# EAGLE design DC4dazzer2 (EAGLE 6.3)
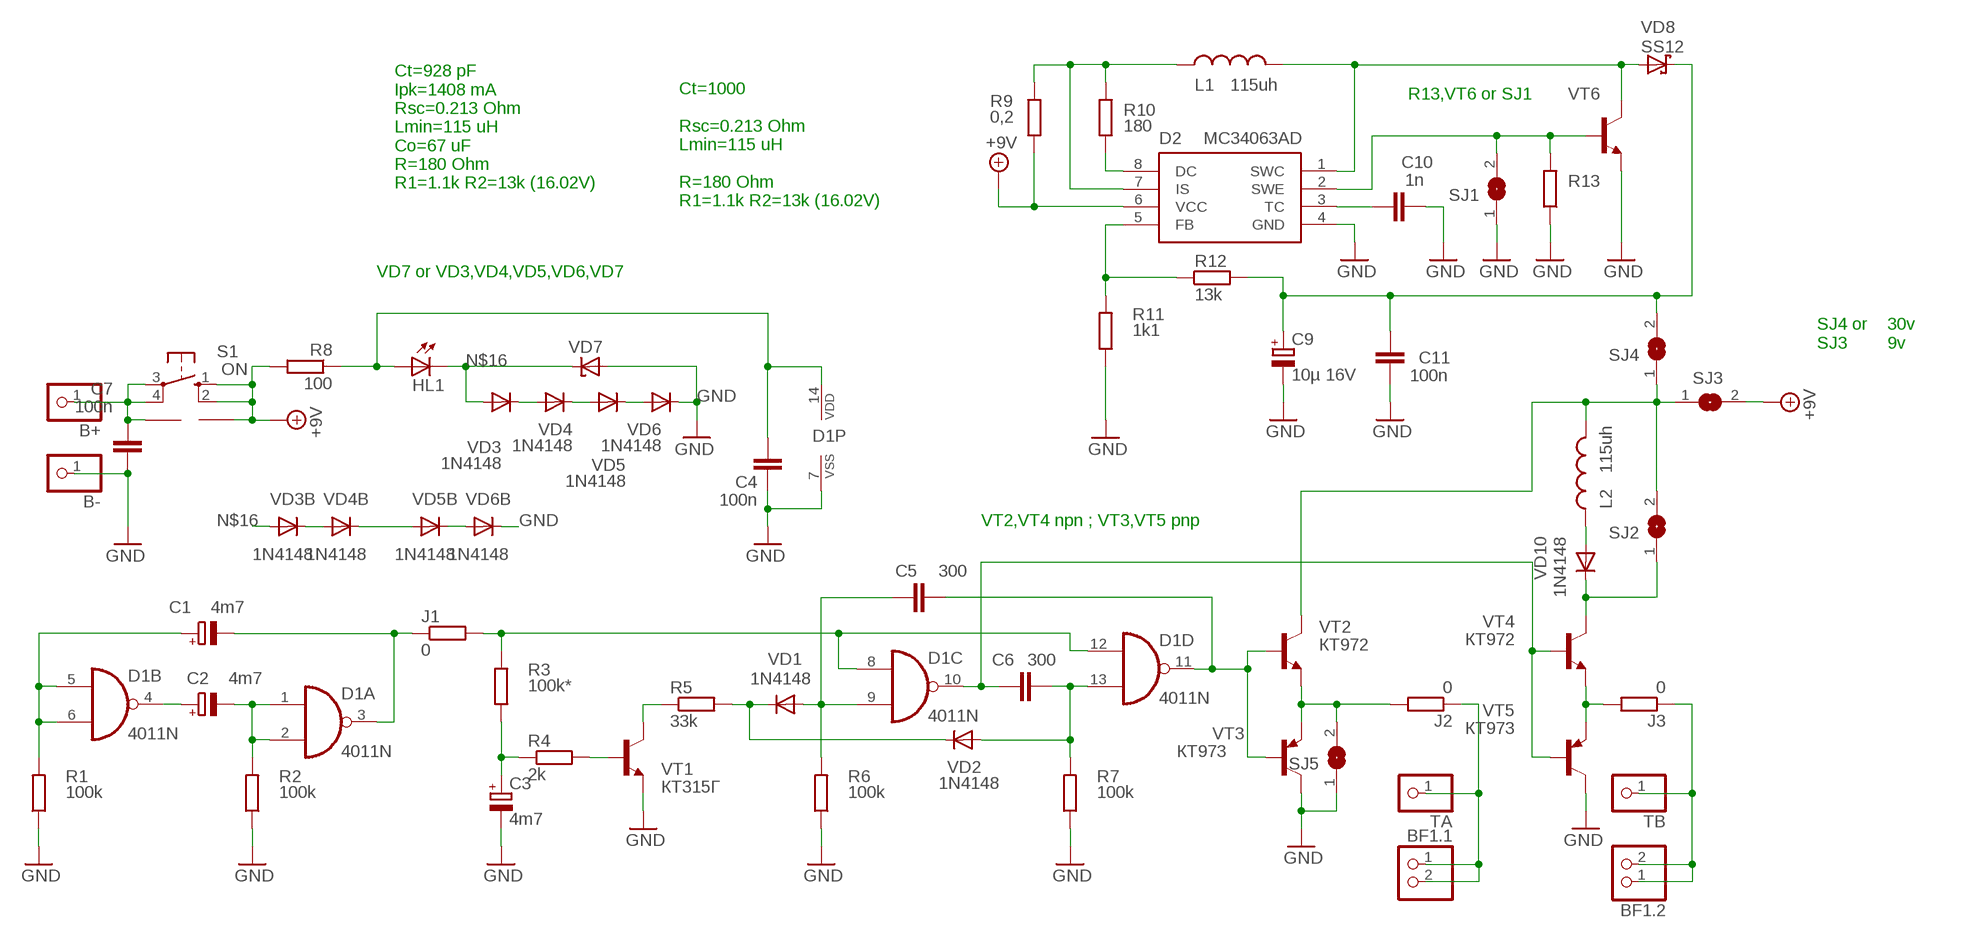
[diagram p0: schematic, sheet 1]

## Parts
B+  PINHD-1X1  [1X01]
B-  PINHD-1X1  [1X01]
BF1.1  PINHD-1X2  [1X02]
BF1.2  PINHD-1X2  [1X02]
C1  4m7  CPOL-EUE3.5-8  [E3,5-8]
C2  4m7  CPOL-EUE2.5-7  [E2,5-7]
C3  4m7  CPOL-EUE2.5-7  [E2,5-7]
C4  100n  C-EUC0805  [C0805]
C5  300  CAPPTH3  [CAP-PTH-LARGE]
C6  300  CAPPTH3  [CAP-PTH-LARGE]
C7  100n  C-EU025-024X044  [C025-024X044]
C9  10µ 16V  RCL_CPOL-EUE3.5-8  [RCL_E3,5-8]
C10  1n  C-EU025-025X050  [C025-025X050]
C11  100n  C-EUC0805  [C0805]
D1  4011N  [DIL14]
D2  MC34063AD  [SOIC8]
HL1  LED5MM  [LED5MM]
J1  0  R-EU_R1206W  [R1206W]
J2  0  R-EU_R1206W  [R1206W]
J3  0  R-EU_R1206W  [R1206W]
L1  115uh  L-US0207/10  [0207/10]
L2  115uh  L-US0204/5  [0204/5]
R1  100k  R-EU_R0805  [R0805]
R2  100k  R-EU_R0805  [R0805]
R3  100k*  R-EU_0204/7  [0204/7]
R4  2k  R-EU_R0805  [R0805]
R5  33k  R-EU_R1206W  [R1206W]
R6  100k  R-EU_R1206W  [R1206W]
R7  100k  R-EU_M0805  [M0805]
R8  100  R-EU_0204/5  [0204/5]
R9  0,2  R-EU_0204/7  [0204/7]
R10  180  R-EU_0204/7  [0204/7]
R11  1k1  R-EU_M0805  [M0805]
R12  13k  R-EU_M0805  [M0805]
R13  R-EU_0204/7  [0204/7]
S1  ON  10-XX  [B3F-10XX]
SJ1  SJ  [SJ]
SJ2  SJ  [SJ]
SJ3  SJ  [SJ]
SJ4  SJ  [SJ]
SJ5  SJ  [SJ]
TA  PINHD-1X1  [1X01]
TB  PINHD-1X1  [1X01]
U$2  PROGRAMMER_5.08  [PROGRAMMER_KEY]
VD1  1N4148  DIODE-SOD80C  [SOD80C]
VD2  1N4148  DIODE-SOD80C  [SOD80C]
VD3  1N4148  1N4148DO35-7  [DO35-7]
VD3B  1N4148  DIODE-SOD80C  [SOD80C]
VD4  1N4148  1N4148DO35-7  [DO35-7]
VD4B  1N4148  DIODE-SOD80C  [SOD80C]
VD5  1N4148  1N4148DO35-7  [DO35-7]
VD5B  1N4148  DIODE-SOD80C  [SOD80C]
VD6  1N4148  1N4148DO35-7  [DO35-7]
VD6B  1N4148  DIODE-SOD80C  [SOD80C]
VD7  ZENER-DIODEZD-7.5  [ZDIO-7.5]
VD8  SS12  SCHOTTKY-DIODESMD  [SMB]
VD10  1N4148  DIODE-SOD80C  [SOD80C]
VT1  КТ315Г  BC167-NPN-TO92-ECB  [TO92-ECB]
VT2  КТ972  BC167-NPN-TO92-ECB  [TO92-ECB]
VT3  КТ973  BC369-PNP-TO92-BCE  [TO92-BCE]
VT4  КТ972  BC167-NPN-TO92-ECB  [TO92-ECB]
VT5  КТ973  BC369-PNP-TO92-BCE  [TO92-BCE]
VT6  BC167-NPN-TO92-ECB  [TO92-ECB]

## Nets
+9V: D2.6(VCC) R8.2 R9.1 S1.1(S) S1.2(S1) SJ3.2 U$2.P$2
B+: B+.1 C7.1 S1.3(P) S1.4(P1) U$2.P$1
GND: B-.1 C3.- C4.2 C7.2 C9.- C10.2 C11.1 D1.7(P:VSS) D2.4(GND) R1.1 R2.1 R6.1 R7.1 R11.1 R13.1 SJ1.1 SJ5.1 VD6.C VD6B.C VD7.A VT1.E VT3.C VT5.C VT6.E
N$1: C1.+ D1.5(B:I0) D1.6(B:I1) R1.2
N$2: C2.+ D1.4(B:O)
N$3: C2.- D1.1(A:I0) D1.2(A:I1) R2.2
N$4: D1.8(C:I0) D1.12(D:I0) J1.2 R3.2
N$5: C3.+ R3.1 R4.1
N$6: R4.2 VT1.B
N$7: R5.1 VT1.C
N$8: R5.2 VD1.C VD2.C
N$9: C5.1 D1.9(C:I1) R6.2 VD1.A
N$10: C6.1 D1.10(C:O) VT4.B VT5.B
N$11: C6.2 D1.13(D:I1) R7.2 VD2.A
N$12: J2.2 SJ5.2 VT2.E VT3.E
N$13: J3.2 VT4.E VT5.E
N$14: C5.2 D1.11(D:O) VT2.B VT3.B
N$15: C1.- D1.3(A:O) J1.1
N$16: HL1.K(C) VD3.A VD3B.A VD7.C
N$17: D2.8(DC) R10.1
N$19: BF1.2.1 BF1.2.2 J3.1 TB.1
N$20: D2.7(IS) L1.1 R9.2 R10.2
N$21: VD3.C VD3B.C VD4.A VD4B.A
N$22: VD4.C VD4B.C VD5.A VD5B.A
N$23: VD5.C VD5B.C VD6.A VD6B.A
N$24: BF1.1.1 BF1.1.2 J2.1 TA.1
N$25: D2.5(FB) R11.2 R12.1
N$26: D2.2(SWE) R13.2 SJ1.2 VT6.B
N$27: C10.1 D2.3(TC)
N$28: D2.1(SWC) L1.2 VD8.A VT6.C
N$29: C9.+ C11.2 R12.2 SJ4.2 VD8.C
N$30: L2.1 VD10.A
N$31: SJ2.1 VD10.C VT4.C
N$33: L2.2 SJ2.2 SJ3.1 SJ4.1 VT2.C
~+5V: C4.1 D1.14(P:VDD) HL1.A R8.1

## Notes on the sheet
- R13,VT6 or SJ1
- Ct=928 pF
  Ipk=1408 mA
  Rsc=0.213 Ohm
  Lmin=115 uH
  Co=67 uF
  R=180 Ohm
  R1=1.1k R2=13k (16.02V)
- Ct=1000
  
  Rsc=0.213 Ohm
  Lmin=115 uH
  
  R=180 Ohm
  R1=1.1k R2=13k (16.02V)
- VD7 or VD3,VD4,VD5,VD6,VD7
- SJ4 or    30v
  SJ3        9v
- VT2,VT4 npn ; VT3,VT5 pnp

## Library data of the parts
B+ B- TA TB = pinhead:PINHD-1X1: PIN HEADER
BF1.1 BF1.2 = pinhead:PINHD-1X2: PIN HEADER
C1-C3 = rcl:CPOL-EU: POLARIZED CAPACITOR, European symbol
C4 C10 C11 = rcl:C-EU: CAPACITOR, European symbol
C5 C6 = SparkFun-Capacitors:CAP: Capacitor Standard 0603 ceramic capacitor, and 0.1" leaded capacitor.
C7 = rc-elektronik:C-EU: CAPACITOR, European symbol
C9 = HWProgUSB:RCL_CPOL-EU: POLARIZED CAPACITOR, European symbol
D1 = 40xx:4011: Quad 2-input NAND
D2 = mc34063:MC34063
HL1 = led:LED: LED OSRAM: - CHIPLED LG R971, LG N971, LY N971, LG Q971, LY Q971, LO R971, LY R971 LH N974, LH R974 LS Q976, LO Q976, LY Q976 LO Q996 - Hyper CHIPLED LW Q18S LB Q993, LB Q99A, LB R99A - SideLED LS A670, LO A670, LY A670, LG A670, LP A670 LB A673, LV A673, LT A673, LW A673 LH A674 LY A675 LS A676, LA A676, LO A676, LY A676, LW A676 LS A679, LY A679, LG A679 - Hyper Micro SIDELED® LS Y876, LA Y876, LO Y876, LY Y876 LT Y87S - SmartLED LW L88C, LW L88S LB L89C, LB L89S, LG L890 LS L89K, LO L89K, LY L89K LS L896, LA L896, LO L896, LY L896 - TOPLED LS T670, LO T670, LY T670, LG T670, LP T670 LSG T670, LSP T670, LSY T670, LOP T670, LYG T670 LG T671, LOG T671, LSG T671 LB T673, LV T673, LT T673, LW T673 LH T674 LS T676, LA T676, LO T676, LY T676, LB T676, LH T676, LSB T676, LW T676 LB T67C, LV T67C, LT T67C, LS T67K, LO T67K, LY T67K, LW E67C LS E67B, LA E67B, LO E67B, LY E67B, LB E67C, LV E67C, LT E67C LW T67C LS T679, LY T679, LG T679 LS T770, LO T770, LY T770, LG T770, LP T770 LB T773, LV T773, LT T773, LW T773 LH T774 LS E675, LA E675, LY E675, LS T675 LS T776, LA T776, LO T776, LY T776, LB T776 LHGB T686 LT T68C, LB T68C - Hyper Mini TOPLED® LB M676 - Mini TOPLED Santana® LG M470 LS M47K, LO M47K, LY M47K Source: http://www.osram.convergy.de LUXEON: - LUMILED® LXK2-PW12-R00, LXK2-PW12-S00, LXK2-PW14-U00, LXK2-PW14-V00 LXK2-PM12-R00, LXK2-PM12-S00, LXK2-PM14-U00 LXK2-PE12-Q00, LXK2-PE12-R00, LXK2-PE12-S00, LXK2-PE14-T00, LXK2-PE14-U00 LXK2-PB12-K00, LXK2-PB12-L00, LXK2-PB12-M00, LXK2-PB14-N00, LXK2-PB14-P00, LXK2-PB14-Q00 LXK2-PR12-L00, LXK2-PR12-M00, LXK2-PR14-Q00, LXK2-PR14-R00 LXK2-PD12-Q00, LXK2-PD12-R00, LXK2-PD12-S00 LXK2-PH12-R00, LXK2-PH12-S00 LXK2-PL12-P00, LXK2-PL12-Q00, LXK2-PL12-R00 Source: www.luxeon.com KINGBRIGHT: KA-3528ASYC Source: www.kingbright.com
J1-J3 R1-R13 = rcl:R-EU_: RESISTOR, European symbol
L1 L2 = rcl:L-US: INDUCTOR, American symbol
S1 = switch-omron:10-XX: OMRON SWITCH; MPN: B3F-1000; OC_FARNELL: 176432; OC_NEWARK: 36M3542
SJ1-SJ5 = jumper:SJ: SMD solder JUMPER
U$2 = HWProgUSB:PROGRAMMER_5.08
VD1 VD2 VD3B VD4B VD5B VD6B VD10 = diode:DIODE-: DIODE
VD3-VD6 = diode:1N4148: DIODE high speed (Philips)
VD7 = diode:ZENER-DIODE: Z-Diode
VD8 = diode:SCHOTTKY-DIODE: Schottky Diode
VT1 VT2 VT4 VT6 = transistor:*-NPN-: NPN Transistror BF959 corrected 2008.03.06
VT3 VT5 = transistor:*-PNP-: PNP Transistror

## Board
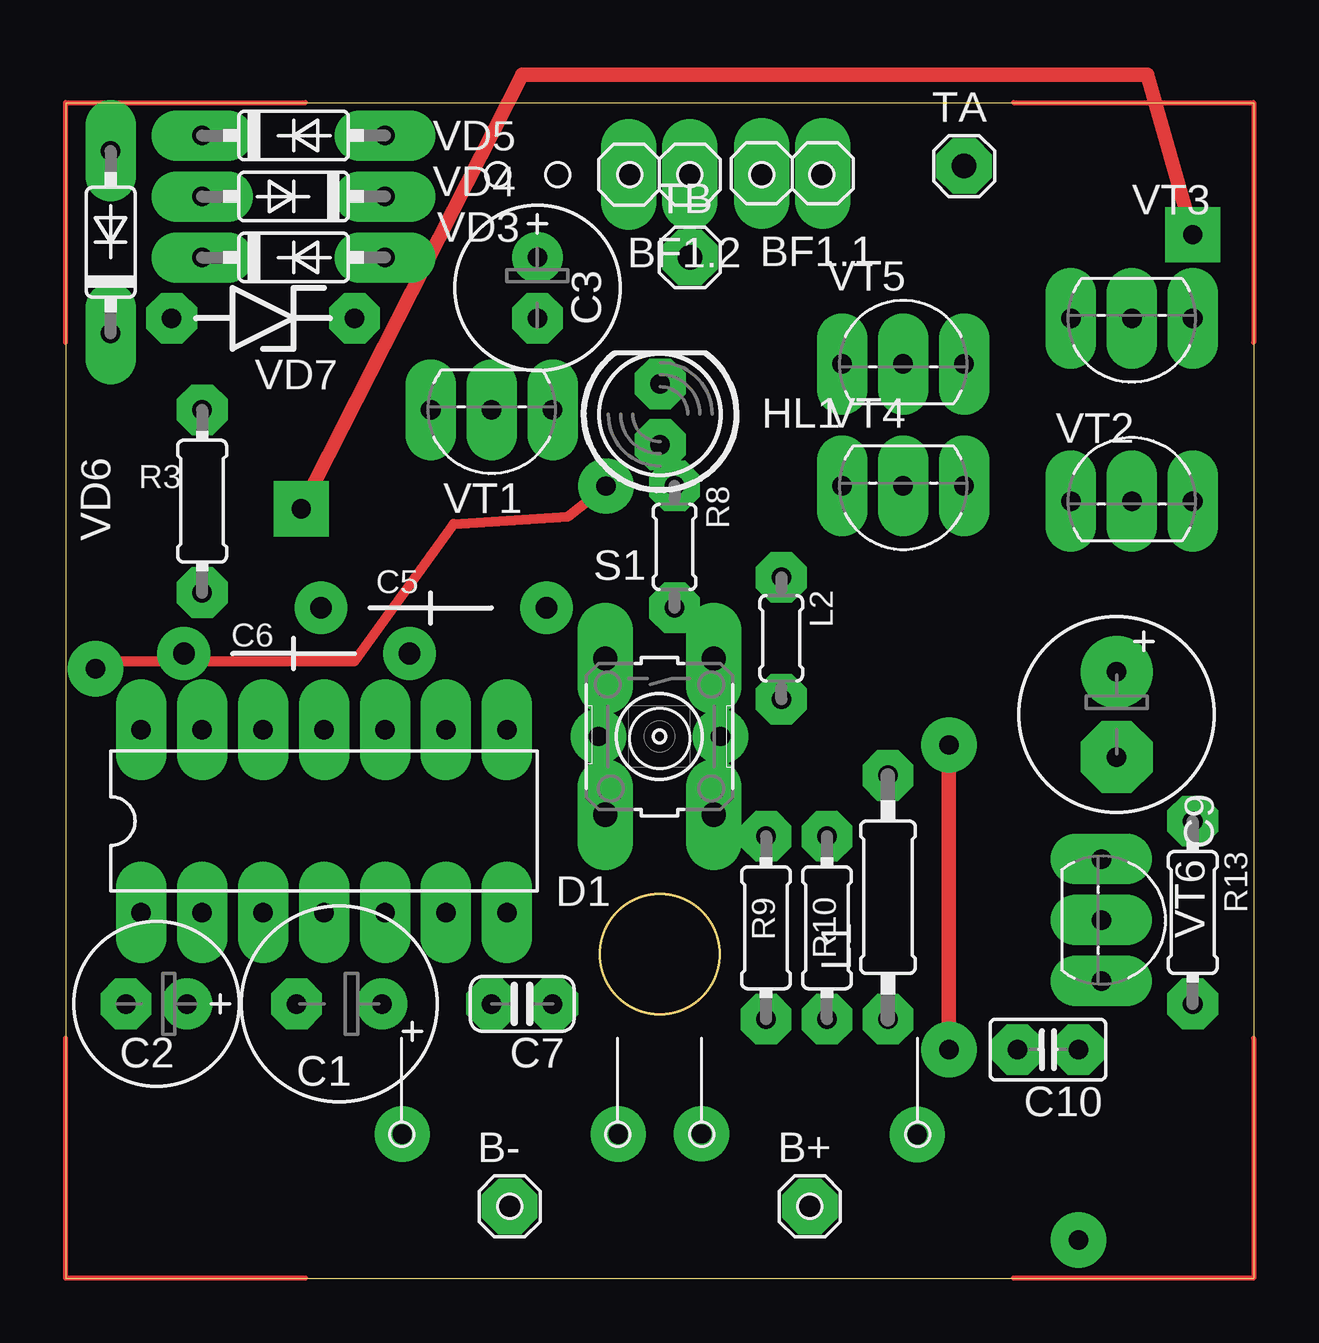
[diagram p1: board, top side]
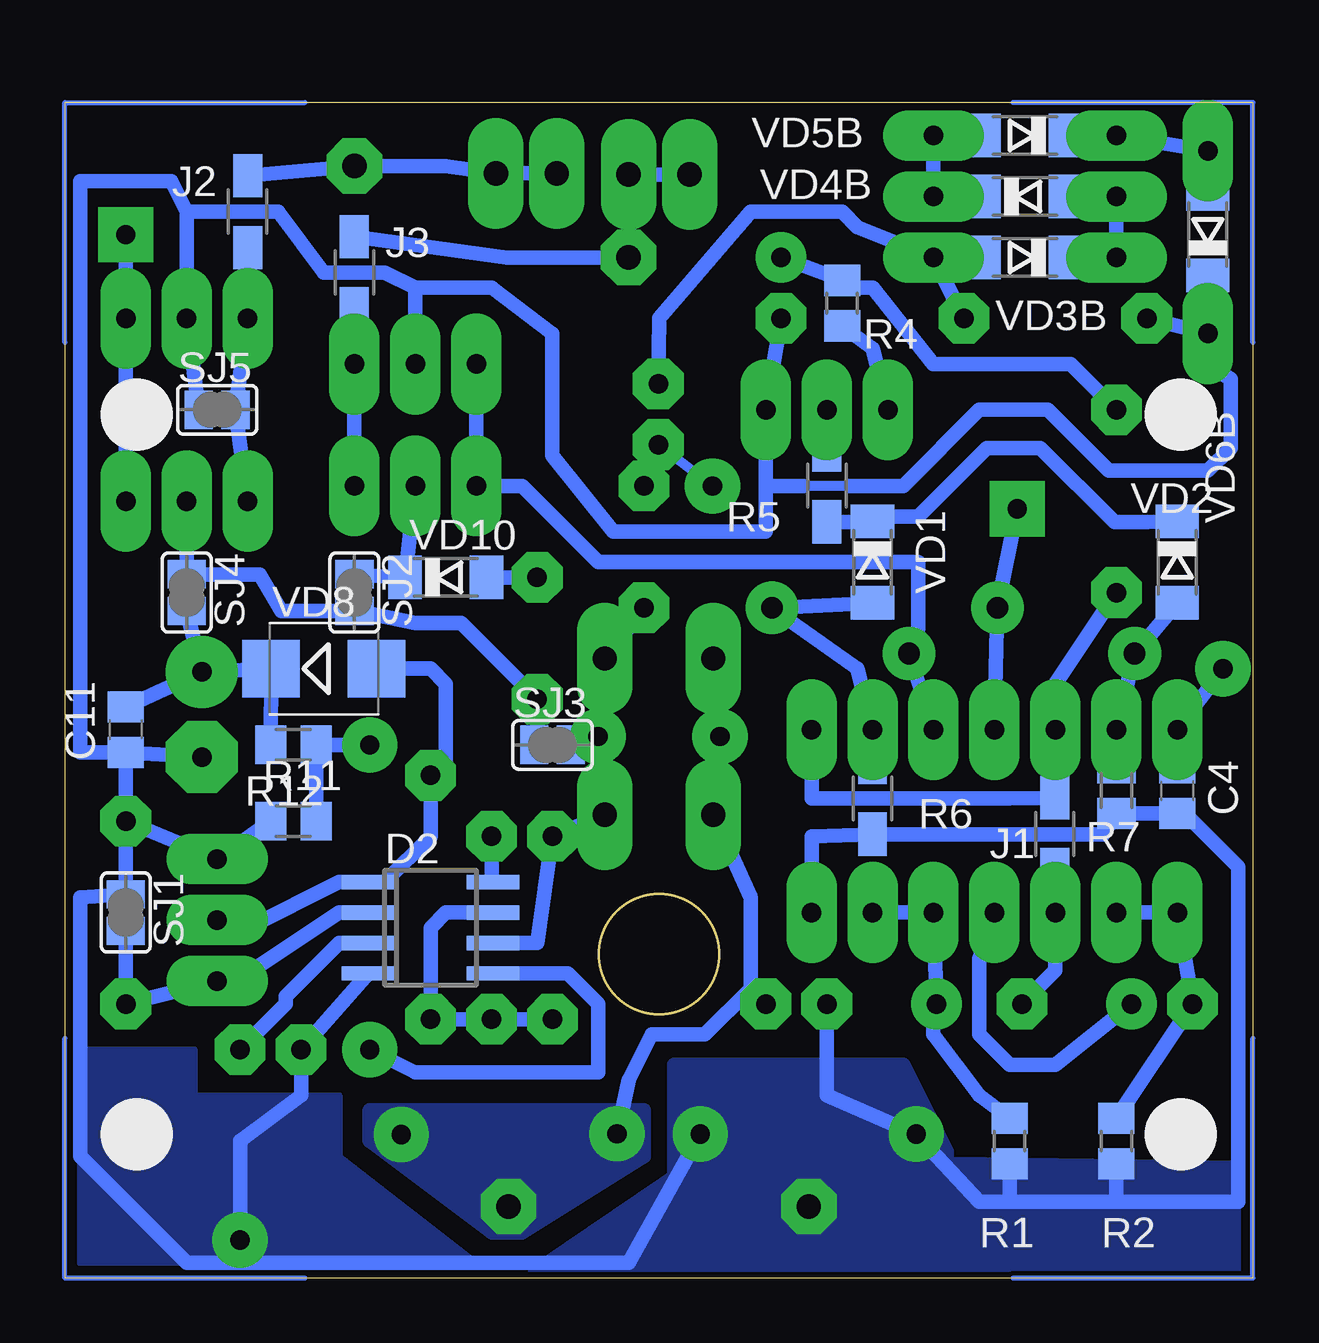
[diagram p2: board, bottom side, seen from below]

Size 49.5 x 49 mm. Coordinates in mm from the lower left corner, seen from the top.
Copper layers (1*16): Top 0.035mm / dielectric 1.5mm / Bottom 0.035mm
Design rules "DesignRules": minimum track width 8mil, minimum drill 24mil, track to track 0.2mm, track to pad 0.2mm, pad to pad 8mil, via to via 8mil, smd to smd 8mil, copper to edge 10mil, drill to drill 8mil, minimum pad ring 0.65mm, minimum via ring 8mil, stop-mask expansion 4mil, vias tented up to drill 0mil, thermal gap 10mil

### Footprints (pad centres in the part's own frame; a part is rotated, then mirrored left to right if it is on the bottom)
1X01 = drill 1.016 octagon: 1 0,0
1X02 = drill 1.016 long: 1 -1.27,0; 2 1.27,0
E3,5-8 = drill 0.813 pad 1.6: + -1.778,0 | drill 0.813 pad 1.6 octagon: - 1.778,0
E2,5-7 = drill 0.813 pad 1.6: + -1.27,0 | drill 0.813 pad 1.6 octagon: - 1.27,0
C0805 = smd 1.3 x 1.5: 1 -0.95,0; 2 0.95,0
CAP-PTH-LARGE = drill 0.9 pad 1.905: 1 -4.826,0; 2 4.572,0
C025-024X044 = drill 0.813 octagon: 1 -1.27,0; 2 1.27,0
RCL_E3,5-8 = drill 0.813 pad 3: + -1.778,0 | drill 0.813 pad 3 octagon: - 1.778,0
C025-025X050 = drill 0.813 octagon: 1 -1.27,0; 2 1.27,0
DIL14 = drill 0.813 long: 1 -7.62,-3.81; 2 -5.08,-3.81; 3 -2.54,-3.81; 4 0,-3.81; 5 2.54,-3.81; 6 5.08,-3.81; 7 7.62,-3.81; 8 7.62,3.81; 9 5.08,3.81; 10 2.54,3.81; 11 0,3.81; 12 -2.54,3.81; 13 -5.08,3.81; 14 -7.62,3.81
SOIC8 = smd 0.6 x 2.2: 1 -1.905,-2.6; 2 -0.635,-2.6; 3 0.635,-2.6; 4 1.905,-2.6; 5 1.905,2.6; 6 0.635,2.6; 7 -0.635,2.6; 8 -1.905,2.6
LED5MM = drill 0.813 octagon: A -1.27,0; K 1.27,0
R1206W = smd 1.8 x 1.2: 1 -1.499,0; 2 1.499,0
0207/10 = drill 0.813 octagon: 1 -5.08,0; 2 5.08,0
0204/5 = drill 0.813 octagon: 1 -2.54,0; 2 2.54,0
R0805 = smd 1.3 x 1.5: 1 -0.95,0; 2 0.95,0
0204/7 = drill 0.813 octagon: 1 -3.81,0; 2 3.81,0
M0805 = smd 1.3 x 1.6: 1 -0.95,0; 2 0.95,0
B3F-10XX = drill 1.016 long: 1 -3.251,2.261; 2 3.251,2.261; 3 -3.251,-2.261; 4 3.251,-2.261
SJ = smd 1.168 x 1.6: 1 -0.762,0; 2 0.762,0
DAZZER2PL = hole 5: -24.75,13.5
PROGRAMMER_KEY = drill 0.8 pad 2.3: P$1 -2.54,0.635; P$2 2.54,0.635
SOD80C = smd 1.4 x 1.8: A 1.7,0; C -1.7,0
DO35-7 = drill 0.813 long: A 3.81,0; C -3.81,0
ZDIO-7.5 = drill 0.813 octagon: A 3.81,0; C -3.81,0
SMB = smd 2.4 x 2.4: A 2.2,0; C -2.2,0
TO92-ECB = drill 0.813 long: B 2.54,0; C 0,0; E -2.54,0
TO92-BCE = drill 0.813 long: B -2.54,0; C 0,0; E 2.54,0

### Placement (x,y rotation side)
B+  31.01,2.99 0 top
B-  18.5,2.99 0 top
BF1.1  30.27,46.05 0 top
BF1.2  24.74,46 0 top
C1  11.4,11.43 180 top
C2  3.78,11.43 180 top
C3  19.65,41.27 270 top
C4  3.14,20.32 270 bottom
C5  15.21,27.94 180 top
C6  9.49,26.04 180 top
C7  19.02,11.43 180 top
C9  43.78,23.5 270 top
C10  40.93,9.53 180 top
C11  46.96,22.86 90 bottom
D1  10.76,19.05 0 top
D2  34.26,14.61 270 bottom
HL1  24.77,36.01 90 top
J1  8.25,18.52 90 bottom
J2  41.88,44.45 270 bottom
J3  37.44,41.91 270 bottom
L1  34.26,15.88 90 top
L2  29.81,26.67 270 top
R1  10.13,5.71 90 bottom
R2  5.68,5.71 90 bottom
R3  5.68,32.38 270 top
R4  17.11,40.64 270 bottom
R5  17.75,33.02 270 bottom
R6  15.84,20 90 bottom
R7  5.68,20.32 90 bottom
R8  25.37,30.48 270 top
R9  29.18,14.61 270 top
R10  31.72,14.61 270 top
R11  39.98,19.05 0 bottom
R12  39.98,22.23 180 bottom
R13  46.96,15.24 270 top
S1  24.74,22.57 270 top
SJ1  46.96,15.24 270 bottom
SJ2  37.44,28.57 270 bottom
SJ3  29.18,22.23 0 bottom
SJ4  44.42,28.57 270 bottom
SJ5  43.15,36.2 0 bottom
TA  37.44,46.35 0 top
TB  26,42.55 0 top
U$1  [DAZZER2PL]  49.5,0 0 top
U$2  24.74,21.94 0 top
VD1  15.84,29.84 270 bottom
VD2  3.14,29.84 270 bottom
VD3  9.49,42.55 0 top
VD3B  9.49,42.55 180 bottom
VD4  9.49,45.09 180 top
VD4B  9.49,45.09 0 bottom
VD5  9.49,47.62 0 top
VD5B  9.49,47.62 180 bottom
VD6  1.87,43.18 90 top
VD6B  1.87,43.5 90 bottom
VD7  8.22,40.01 180 top
VD8  38.7,25.4 0 bottom
VD10  33.62,29.21 0 bottom
VT1  17.75,36.2 180 top
VT2  44.42,32.38 0 top
VT3  44.42,40.01 180 top
VT4  34.89,33.02 180 top
VT5  34.89,38.1 0 top
VT6  43.15,14.92 270 top

### Tracks (layer width: path | path; a pad name or v marks a point on that pad's centre or on a via)
+9V
  Bottom 0.61: U$2.P$2 S1.1 R8.2 | U$2.P$2 S1.2 R9.1 29.81,13.97 D2.6 | U$2.P$2 27.63,22.23 SJ3.2
B+  (via drill 0.8 pad 2.3)
  Bottom 0.61: S1.3 U$2.P$1 S1.4 20.92,15.88 20.92,12.06 | 20.92,12.06 22.83,10.16 25.05,10.16 26,8.26 v26.49,6.01 | C7.1 20.92,12.06
  other vias: 35.48,5.98
  pour Bottom (no thermals): 25.37,6.99 25.37,5.08 30.45,1.91 31.72,1.91 36.8,5.71 36.8,6.99
GND  (via drill 0.8 pad 2.3)
  Bottom 0.406: VD6.C VD6B.C | 16.8,33.02 18.7,33.02
  Bottom 0.61: D1.7 18.38,18.41 R6.1 6.23,18.5 R7.1 C4.2 2.83,19.37 0.6,17.14 0.6,3.17 5.68,3.17 | 5.68,3.17 10.13,3.17 | 10.13,3.17 11.4,3.17 v14.02,6 17.75,7.62 C7.2 | 10.13,3.17 R1.1 | R2.1 5.68,3.17 | C3.- VT1.E 20.29,33.02 | 42.2,0.64 44.42,0.64 48.87,5.08 48.87,15.88 SJ1.1 R13.1 | 42.2,0.64 26,0.64 v23.02,6 | 20.29,33.02 20.29,31.11 26.64,31.11 29.18,34.29 29.18,39.37 31.72,41.27 34.89,41.27 | SJ5.1 VT3.C 44.42,44.45 | 44.42,44.45 45.05,45.72 48.87,45.72 48.87,21.91 C11.1 | 44.42,44.45 40.61,44.45 38.7,41.91 36.16,41.91 34.89,41.27 | VT5.C 34.89,41.27 | C11.1 C9.- | R11.1 VT6.E R13.1 | D2.4 C10.2 39.66,7.62 42.2,5.71 42.2,0.64 | R13.1 C11.1 | VD7.A VD6.C 1.87,38.1 0.92,37.47 0.92,34.61 1.87,33.66 6,33.66 8.54,36.2 11.4,36.2 14.57,33.02 16.8,33.02 | 18.7,33.02 20.29,33.02
  other vias: 42.2,1.59
  pour Bottom (no thermals): 14.57,8.89 24.1,8.89 24.1,4.13 19.02,1.91 17.75,1.91 12.67,5.08
  pour Bottom (no thermals): 0.6,4.76 23.15,5.08 30.13,0.32 0.6,0.32
  pour Bottom (no thermals): 48.87,9.53 44.1,9.53 44.1,7.62 38.07,7.62 38.07,5.08 32.35,0.64 48.87,0.64
N$1
  Bottom 0.61: D1.6 D1.5 C1.+ 13.3,11.3 13.3,10.16 11.4,7.62 R1.2
N$2
  Bottom 0.61: D1.4 11.4,13.34 11.4,10.16 10.13,8.89 8.22,8.89 C2.+
N$3
  Bottom 0.61: D1.2 D1.1 C2.- R2.2
N$4
  Bottom 0.61: D1.8 18.38,20 10.13,20 J1.2 | J1.2 8.45,20.23 | J1.2 D1.12 8.22,24.77 R3.2
N$5
  Bottom 0.61: C3.+ R4.1 16.48,41.27 15.84,41.27 13.3,38.1 7.59,38.1 R3.1
N$6
  Bottom 0.61: R4.2 15.84,38.73 VT1.B
N$7
  Bottom 0.61: VT1.C R5.1
N$8
  Bottom 0.61: R5.2 16.5,31.51 VD1.C 15.64,31.75 13.94,31.75 11.08,34.61 8.86,34.61 5.76,31.51 4.38,31.51 VD2.C
N$9
  Bottom 0.61: VD1.A C5.1 16.48,25.4 D1.9 R6.2
N$10
  Bottom 0.61: D1.10 C6.1 13.94,27.05 13.94,29.84 27.27,29.84 30.45,33.02 VT4.B VT5.B
N$11
  Bottom 0.61: R7.2 D1.13 C6.2 VD2.A
N$12
  Bottom 0.61: J2.2 VT3.E SJ5.2 VT2.E
N$13
  Bottom 0.61: VT4.E VT5.E J3.2
N$14  (via drill 0.8 pad 2.3)
  Top 0.61: v9.81,32.07 19.02,50.16 45.05,50.16 v46.96,43.5
  Bottom 0.61: D1.11 C5.2 v9.81,32.07 | VT2.B VT3.B v46.96,43.5
N$15
  Bottom 0.61: J1.1 D1.3 8.22,12.83 C1.-
N$16
  Bottom 0.61: VD3.A 16.48,43.81 17.11,44.45 20.92,44.45 24.73,40.01 HL1.K | VD7.C VD3.A | VD3B.A VD3.A
N$17
  Bottom 0.61: D2.8 31.72,16.51 R10.1
N$19
  Bottom 0.61: BF1.2.1 BF1.2.2 TB.1 31.08,42.55 J3.1
N$20
  Bottom 0.61: R9.2 R10.2 L1.1 34.26,14.61 33.62,15.24 D2.7
N$21
  Bottom 0.61: VD4B.A VD4.A VD3.C VD3B.C
N$22
  Bottom 0.61: VD5B.A VD5.A VD4.C VD4B.C
N$23
  Bottom 0.61: VD6B.A VD6.A VD5.C VD5B.C
N$24
  Bottom 0.61: BF1.1.1 BF1.1.2 33.62,46.35 TA.1 J2.1
N$25  (via drill 0.8 pad 2.3)
  Top 0.61: v36.8,9.53 v36.8,22.23
  Bottom 0.61: R11.2 R12.1 v36.8,22.23 | D2.5 28.54,12.7 27.27,11.43 27.27,8.57 34.89,8.57 v36.8,9.53
N$26
  Bottom 0.61: SJ1.2 R13.2 VT6.B 41.88,12.7 38.07,15.24 D2.2
N$27
  Bottom 0.61: D2.3 38.07,13.97 40.29,11.75 40.29,11.43 C10.1
N$28
  Bottom 0.61: VT6.C 41.88,14.61 38.07,16.51 D2.1 36.16,16.51 34.26,18.41 L1.2 33.62,21.59 33.62,24.77 34.26,25.4 VD8.A
N$29
  Bottom 0.61: C11.2 C9.+ | R12.2 VD8.C C9.+ | SJ4.2 C9.+
N$30
  Bottom 0.61: L2.1 VD10.A
N$31
  Bottom 0.61: VT4.C VD10.C SJ2.1
N$33
  Bottom 0.61: SJ3.1 29.81,22.35 L2.2 32.99,27.3 34.89,27.3 37.31,27.81 SJ2.2 40.48,27.81 41.37,29.34 SJ4.1 VT2.C
~+5V  (via drill 0.8 pad 2.3)
  Top 0.406: v1.24,25.4 1.24,25.72 12.03,25.72 16.16,31.43 20.92,31.75 v22.51,33.02
  Bottom 0.406: v22.51,33.02 HL1.A
  Bottom 0.61: v1.24,25.4 D1.14 C4.1 | R8.1 HL1.A